# EAGLE design Smart Switch (EAGLE 8.4.1)
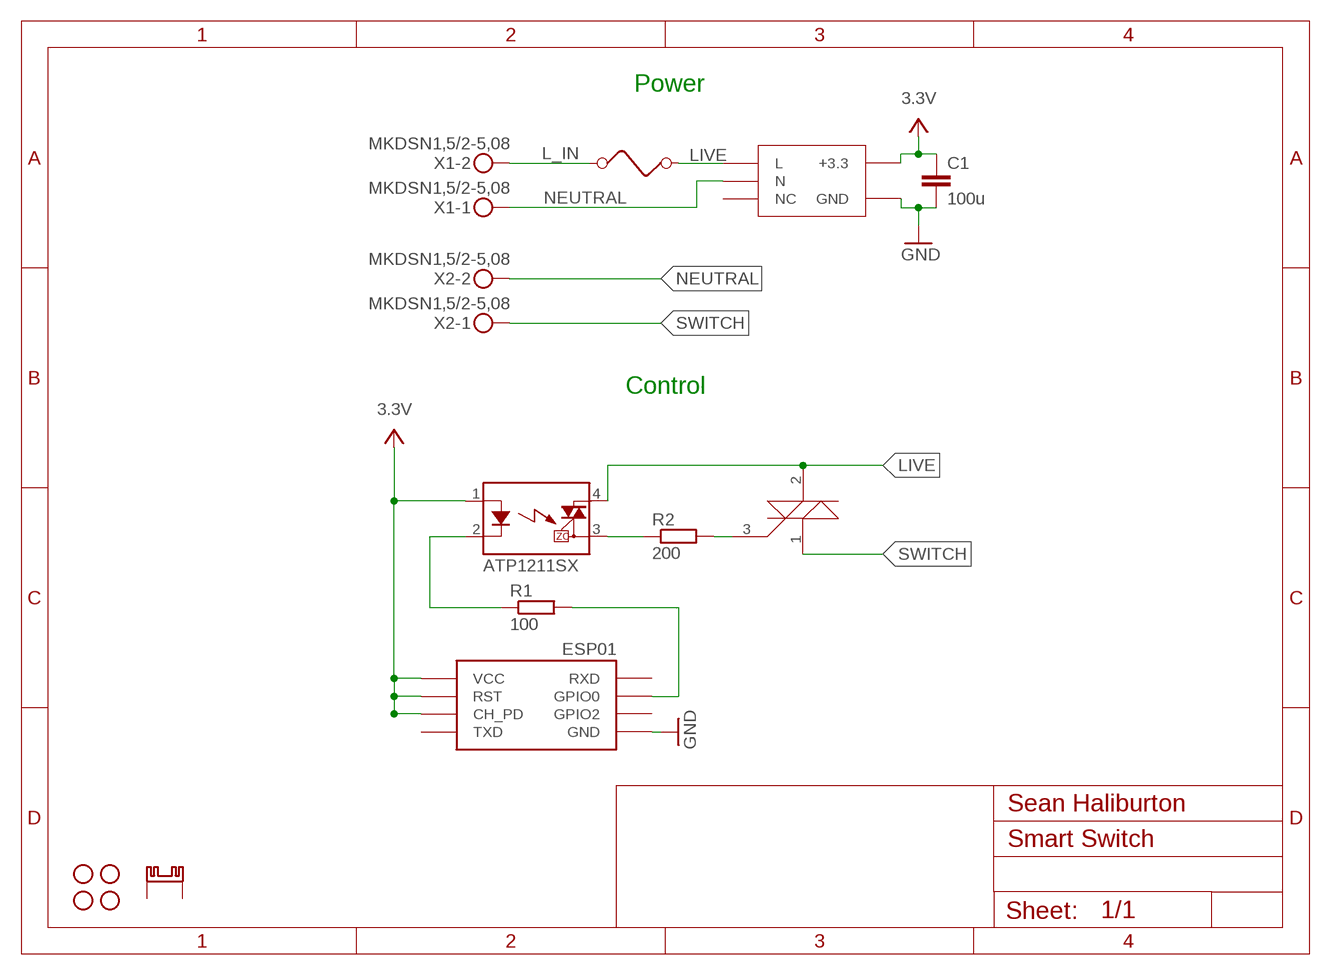
[diagram p0: schematic, sheet 1]

## Parts
C1  100u  C-EUC0805  [C0805]
H1  STAND-OFF  [STAND-OFF]
H2  STAND-OFF  [STAND-OFF]
H3  STAND-OFF  [STAND-OFF]
H4  STAND-OFF  [STAND-OFF]
K1  ATP1211SX  [SOP04]
R1  100  R-EU_R0805  [R0805]
R2  200  R-EU_R0805  [R0805]
U$1  ESP01  [ESP01]
U$2  RAC04-GB  [RAC04-GB]
U$3  BTA16  [TO220V]
U$4  FUSE  [FUSE]
U$5  RA-T2X-38E  [SK129]
X1  MKDSN1,5/2-5,08  [MKDSN1,5/2-5,08]
X2  MKDSN1,5/2-5,08  [MKDSN1,5/2-5,08]

## Nets
GND: C1.2 U$1.GND U$2.GND
GPIO0: R1.2 U$1.GPIO0
L_IN: U$4.P$1 X1.2
LIVE: K1.4(DS1) U$2.L U$3.2(A2) U$4.P$2
N$1: K1.2(K) R1.1
N$5: K1.3(DS2) R2.1
N$6: R2.2 U$3.3(G)
NEUTRAL: U$2.N X1.1 X2.2
SWITCH: U$3.1(A1) X2.1
VCC: C1.1 K1.1(A) U$1.CH_PD U$1.RST U$1.VCC U$2.3.3(+3.3) ; supply symbol labelled 3.3V
Unconnected: U$1.GPIO2 U$1.RX(RXD) U$1.TX(TXD) U$2.NC U$5.A2,5 U$5.B2,5

## Notes on the sheet
- Power
- Control
- Sean Haliburton

## Library data of the parts
C1 = resistor:C-EU: CAPACITOR, European symbol
H1-H4 = SparkFun-Hardware:STAND-OFF: Stand Off Drill holes for mechanically mounting via screws, standoffs, etc. Note: Use the keepout ring to avoid running the screw head into surrounding components. Variant Overviews STAND-OFF - Mechanical footprint for a #4 phillips button head screw. STAND-OFF-TIGHT - Mechanical footprint for a #4 phillips button head screw, Example SparkFun Products Screw - Phillips Head (1/4", 4-40, 10 pack) <https://www.sparkfun.com/products/10453> (PRT-10453) Screw - Phillips Head (1/2", 4-40, 10 pack) <https://www.sparkfun.com/products/10452> (PRT-10452) Screw - Phillips Head (3/4", 4-40, 10 pack) <https://www.sparkfun.com/products/10451> (PRT-10451) Screw - Phillips Head (1", 4-40, 10 pack) <https://www.sparkfun.com/products/10450> (PRT-10450)
K1 = relay:ATP1211S*: Phototriac Coupler with Zero-Cross NAiS Source: http://www.mew-europe.com/.. en_ds_61690_0000.pdf; OC_FARNELL: unknown; OC_NEWARK: unknown
R1 R2 = resistor:R-EU_: RESISTOR, European symbol
U$1 = esp8266modules:ESP01: ESP8266 Wifi module 01
U$2 = smart-switch:RAC04-GB
U$3 = smart-switch:BTA16
U$4 = smart-switch:FUSE
U$5 = smart-switch:RA-T2X-38E
X1 X2 = con-phoenix-508:MKDSN1,5/2-5,08: MKDSN 1,5/ 2-5,08 Printklemme Nennstrom: 13,5 A Nennspannung: 250 V Rastermaß: 5,08 mm Polzahl: 2 Anschlussart: Schraubanschluss Montage: Löten Anschlussrichtung Leiter/Platine: 0 ° Artikelnummer: 1729128 Source: http://eshop.phoenixcontact.com .. 1729128.pdf

## Board
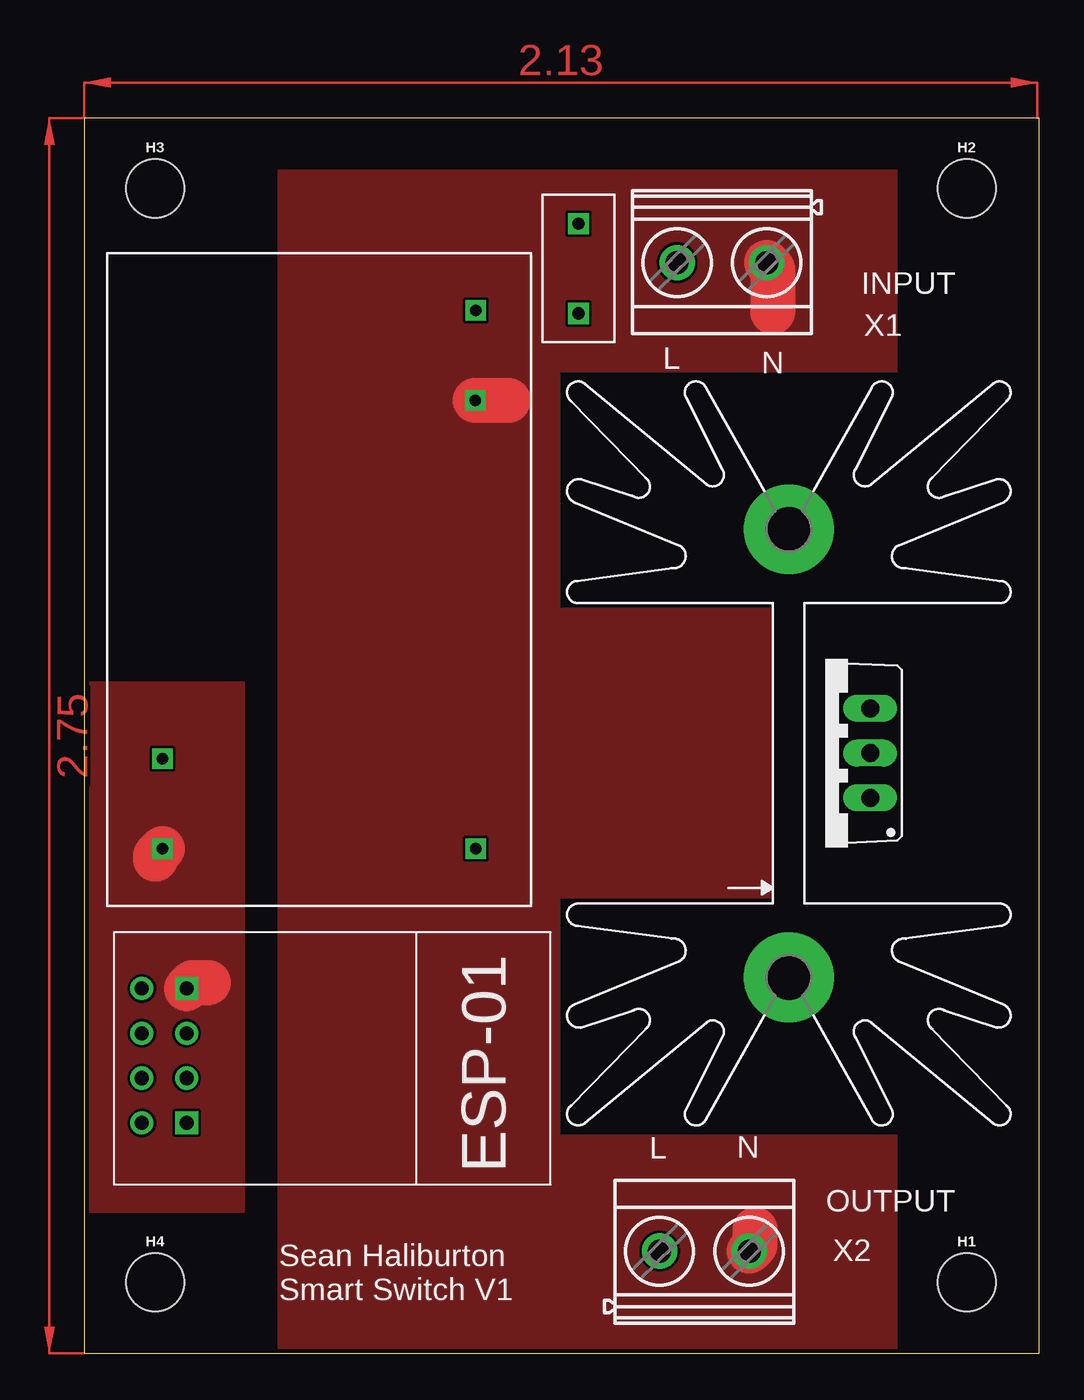
[diagram p1: board, top side]
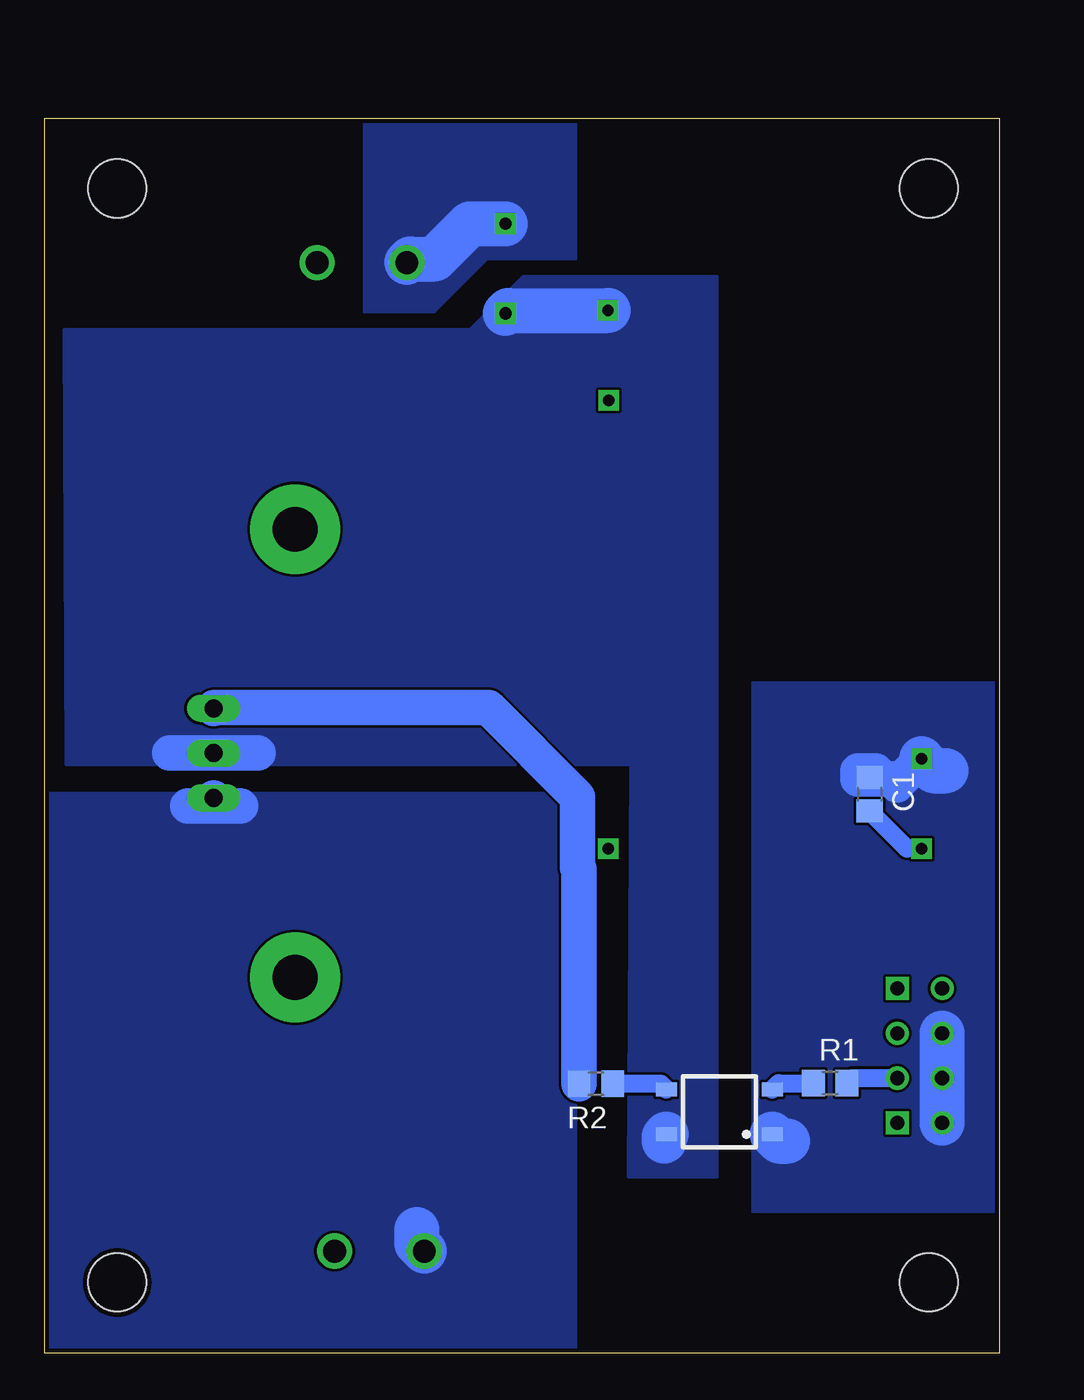
[diagram p2: board, bottom side, seen from below]

Size 54.11 x 69.97 mm. Coordinates in mm from the lower left corner, seen from the top.
Outline: 0,0 54.11,0 54.11,69.97 0,69.97 0,0
Copper layers (1*16): Top 0.035mm / dielectric 1.5mm / Bottom 0.035mm
Design rules "ITEADstudioDRC": minimum track width 6mil, minimum drill 12mil, track to track 6mil, track to pad 6mil, pad to pad 6mil, via to via 6mil, smd to smd 0mil, copper to edge 10mil, drill to drill 10mil, minimum pad ring 10mil, minimum via ring 6mil, stop-mask expansion 2mil, vias tented up to drill 100mil, thermal gap 10mil

### Footprints (pad centres in the part's own frame; a part is rotated, then mirrored left to right if it is on the bottom)
C0805 = smd 1.3 x 1.5: 1 -0.95,0; 2 0.95,0
STAND-OFF = hole 3.302: 0,0
SOP04 = smd 0.8 x 1.2: 1 -1.27,-3; 2 1.27,-3; 3 1.27,3; 4 -1.27,3
R0805 = smd 1.3 x 1.5: 1 -0.95,0; 2 0.95,0
ESP01 = drill 0.8: CH_PD -1.285,-8.178; GPIO0 1.255,-5.638; GPIO2 -1.285,-5.638; RST 1.255,-8.178; TX -3.825,-8.178; VCC 3.795,-8.178 | drill 0.8 square: GND -3.825,-5.638; RX 3.795,-5.638
RAC04-GB = drill 0.65 square: 3.3 -5.08,0; GND 0,0; L -30.49,17.78; N -25.4,17.75; NC 0,17.77
TO220V = drill 1.016 long: 1 -2.54,-2.54; 2 0,-2.54; 3 2.54,-2.54
FUSE = drill 0.7 square: P$1 0,0; P$2 5.08,0
SK129 = drill 2.54 pad 5.08: A2,5 0,-0.127; B2,5 25.4,-0.127
MKDSN1,5/2-5,08 = drill 1.3 pad 2: 1 -2.561,0.025; 2 2.519,0.025

### Placement (x,y rotation side)
C1  7.37,31.67 270 bottom
H1  50,4 0 top
H2  50,66 0 top
H3  4,66 0 top
H4  4,4 0 top
K1  15.88,13.67 90 bottom
R1  9.6,15.29 0 bottom
R2  22.87,15.26 180 bottom
U$1  11.43,16.84 270 top
U$2  4.41,28.59 270 top
U$3  42,34 90 top
U$4  28,64 270 top
U$5  39.8,21.29 90 top
X1  36.11,61.82 180 top
X2  35.16,5.75 0 top

### Tracks (layer width: path | path; a pad name or v marks a point on that pad's centre or on a via)
GND
  Top 2.54: U$2.GND 4.02,28.2 4.02,28 | U$1.GND 6.13,21 7.02,21
  Bottom 1.016: U$2.GND 5.24,28.59 C1.2
  pour Top: -0.98,38 9.02,38 9.02,8 -0.98,8
GPIO0
  Bottom 1.016: R1.2 8.35,15.59 U$1.GPIO0
L_IN
  Bottom 2.54: X1.2 33.39,62 32.02,62 30.02,64 U$4.P$1
  pour Bottom: 36.02,59 36.02,70 24.02,70 24.02,62 29.02,62 32.02,59
LIVE
  Bottom 2: U$3.2 47.02,34 42.02,34
  Bottom 2.54: U$4.P$2 27.84,59.08 U$2.L | K1.4 19.02,12.26 19.02,12
  pour Bottom: 16.02,61 16.02,10 21.02,10 20.89,33.37 52.89,33.37 53.02,58 30.02,58 27.02,61
N$1
  Bottom 1.016: K1.2 12.53,15.29 R1.1
N$5
  Bottom 1.016: K1.3 19.2,15.26 R2.1
N$6
  Bottom 2: R2.2 23.82,27.44 23.91,27.53 23.91,31.51 28.97,36.58 44.5,36.58 U$3.3
NEUTRAL
  Top 2.54: U$2.N 22.17,54 24.02,54 | X1.1 39.02,61.45 39.02,59 | X2.2 38.02,6.11 38.02,7
  pour Top: 46.02,67 46.02,0 11.02,0 11.02,67
SWITCH
  Bottom 2: U$3.1 44.08,31 43.02,31 46.02,31
  Bottom 2.54: X2.1 33.02,6.19 33.02,7
  pour Bottom: 56.15,31.75 24.04,31.75 24.02,-3 55.02,-3 59.29,-3.14 58.53,31.75 56.53,31.75
VCC
  Bottom 2: C1.1 7.02,32.97 7.02,33 8.02,33 8.02,32.52 6.14,32.52 5.82,32.2 5.82,32.26 U$2.3.3
  Bottom 2.54: U$1.VCC U$1.CH_PD | U$2.3.3 3.74,33 3.02,33 | K1.1 12.48,12 12.02,12
  pour Bottom: 14.02,38 14.02,8 -0.98,8 -0.98,38
(copper drawn outside any net)
  shapes: Top area x2

### Text on the board
tNames: INPUT | L | N | L | N | OUTPUT | Sean Haliburton / Smart Switch V1